# Altium schematic sheet Schematic.SchDoc
size A4
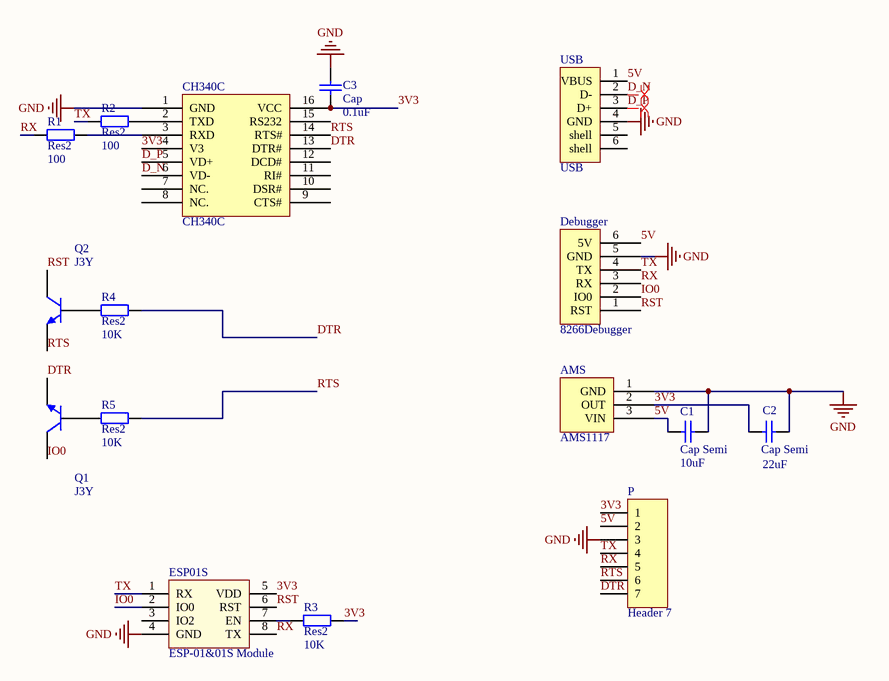
[diagram p0: Schematic.SchDoc]

## Parts
AMS  AMS1117  [SOT-223-2]
C1  Cap Semi  value 10uF  [C1206]
C2  Cap Semi  value 22uF  [C1206]
C3  Cap  value 0.1uF  [C1206]
CH340C  CH340C  [SOP16]
Debugger  8266Debugger  [XH2.54-LI-6P]
ESP01S  ESP-01&01S Module  [ESP-01&01S Module]
P  Header 7  [HDR1X7]
Q1  J3Y  [SOT-23B_N]
Q2  J3Y  [SOT-23B_N]
R1  Res2  value 100  [c1206]
R2  Res2  value 100  [c1206]
R3  Res2  value 10K  [c1206]
R4  Res2  value 10K  [c1206]
R5  Res2  value 10K  [c1206]
USB  USB  [USB-B]

## Nets
GND: AMS.1(GND) C1.2 C2.2 C3.2 CH340C.1(GND) Debugger.5(GND) ESP01S.4(GND) P.3 USB.4(GND)
3V3: AMS.2(OUT) C2.1 C3.1 CH340C.4(V3) CH340C.16(VCC) ESP01S.5(VDD) P.1 R3.1
5V: AMS.3(VIN) C1.1 Debugger.6(5V) P.2 USB.1(VBUS)
D_N: CH340C.6(VD-) USB.2(D-)
D_P: CH340C.5(VD+) USB.3(D+)
DTR: CH340C.13(DTR#) P.7 Q1.3(E) R4.2
IO0: Debugger.2(IO0) ESP01S.2(IO0) Q1.1(C)
RST: Debugger.1(RST) ESP01S.6(RST) Q2.1(C)
RTS: CH340C.14(RTS#) P.6 Q2.3(E) R5.2
RX: Debugger.3(RX) ESP01S.8(TX) P.5 R1.1
TX: Debugger.4(TX) ESP01S.1(RX) P.4 R2.1
NetCH340C_2: CH340C.2(TXD) R2.2
NetCH340C_3: CH340C.3(RXD) R1.2
NetESP01S_7: ESP01S.7(EN) R3.2
NetQ1_2: Q1.2(B) R5.1
NetQ2_2: Q2.2(B) R4.1

Not connected (* = marked no-connect by the designer): CH340C 7(NC.) 8(NC.) 9(CTS#) 10(DSR#) 11(RI#) 12(DCD#) 15(RS232); ESP01S 3(IO2); USB 5(shell) 6(shell)

## Layout directives
differential pair: D_N, D_P

## Library data of the parts
C1 C2 = Cap Semi: Capacitor (Semiconductor SIM Model); Published: 8-Jun-2000; LatestRevisionDate: 29-May-2009; LatestRevisionNote: IPC-7351 Footprint Added.; PackageReference: C1206; Publisher: Altium Limited; PackageDescription: Chip Capacitor
C3 = Cap: Capacitor; Published: 8-Jun-2000; LatestRevisionDate: 17-Jul-2002; LatestRevisionNote: Re-released for DXP Platform.; PackageReference: RAD-0.3; Publisher: Altium Limited; PackageDescription: Radial Cap, Thru-Hole; 2 Leads; 0.3 in Pin Spacing
P = Header 7: Header, 7-Pin; LatestRevisionDate: 17-Jul-2002; LatestRevisionNote: Re-released for DXP Platform.; Publisher: Altium Limited
Q1 Q2 = QNPN: NPN Bipolar Transistor; Published: 8-Jun-2000; LatestRevisionDate: 29-May-2009; LatestRevisionNote: IPC-7351 Footprint Added.; PackageVersion: Aug-1999; PackageReference: SOT-23B; Publisher: Altium Limited; PackageDescription: 3-Pin SOT-23 Package 0.95 mm Pitch, 2.4 mm Lead Span
R1-R5 = Res2: Resistor; Published: 8-Jun-2000; LatestRevisionDate: 17-Jul-2002; LatestRevisionNote: Re-released for DXP Platform.; PackageReference: AXIAL-0.4; Publisher: Altium Limited; PackageDescription: Axial Device, Thru-Hole; 2 Leads; 0.4 in Pin Spacing